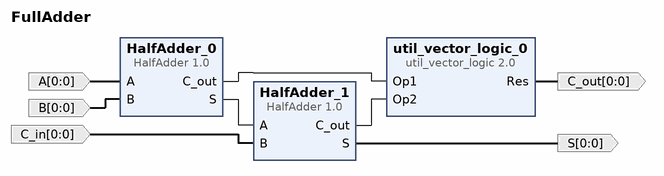
[diagram p0: block diagram of the top level]
# Vivado block design FullAdder, xc7vx485tffg1157-1, Vivado 2019.1
create_bd_design FullAdder

create_bd_port -dir I -from 0 -to 0 A
create_bd_port -dir I -from 0 -to 0 B
create_bd_port -dir I -from 0 -to 0 C_in
create_bd_port -dir O -from 0 -to 0 S
create_bd_port -dir O -from 0 -to 0 C_out

create_bd_cell -type ip -vlnv Group5:user:HalfAdder:1.0 HalfAdder_0
create_bd_cell -type ip -vlnv Group5:user:HalfAdder:1.0 HalfAdder_1
create_bd_cell -type ip -vlnv xilinx.com:ip:util_vector_logic:2.0 util_vector_logic_0
set_property -dict {CONFIG.C_OPERATION or CONFIG.C_SIZE 1} [get_bd_cells util_vector_logic_0]

# ---- connections ----

connect_bd_net [get_bd_ports A] [get_bd_pins HalfAdder_0/A]
connect_bd_net [get_bd_ports B] [get_bd_pins HalfAdder_0/B]
connect_bd_net [get_bd_ports C_in] [get_bd_pins HalfAdder_1/B]
connect_bd_net [get_bd_pins HalfAdder_0/S] [get_bd_pins HalfAdder_1/A]
connect_bd_net [get_bd_pins HalfAdder_1/S] [get_bd_ports S]
connect_bd_net [get_bd_pins HalfAdder_0/C_out] [get_bd_pins util_vector_logic_0/Op1]
connect_bd_net [get_bd_pins HalfAdder_1/C_out] [get_bd_pins util_vector_logic_0/Op2]
connect_bd_net [get_bd_pins util_vector_logic_0/Res] [get_bd_ports C_out]

validate_bd_design
save_bd_design
